# EAGLE design motor_shield__SD_v1.1 (EAGLE 7.6.0)
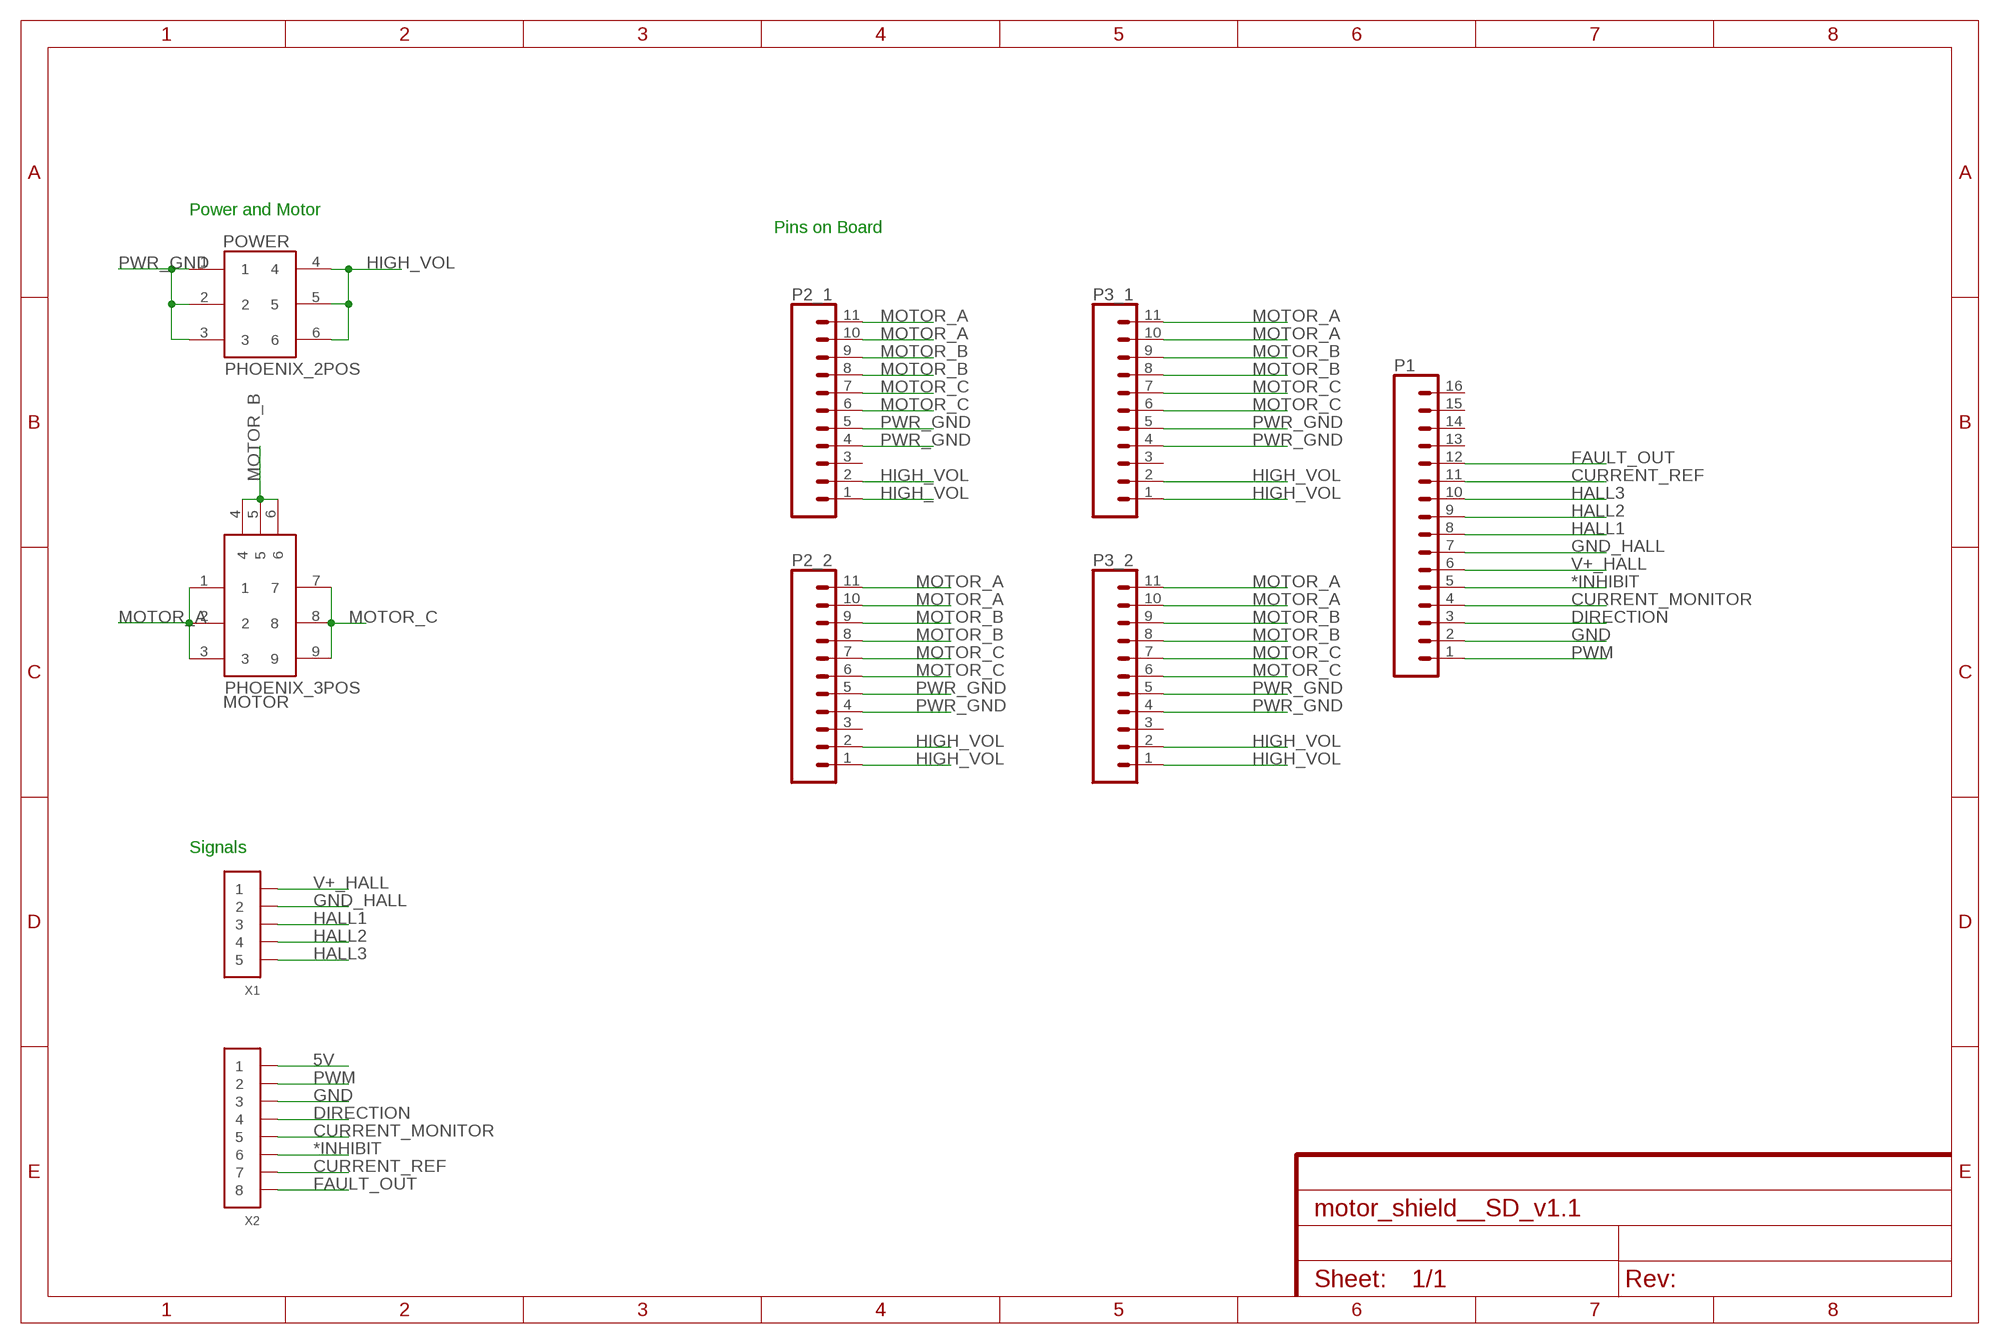
[diagram p0: schematic, sheet 1]

## Parts
MOTOR  PHOENIX_3POS  [PHOENIX_3POS]
P1  CONN_16LOCK  [1X16_LOCK]
P2_1  CONN_11  [1X11]
P2_2  CONN_11  [1X11]
P3_1  CONN_11  [1X11]
P3_2  CONN_11  [1X11]
POWER  PHOENIX_2POS  [PHOENIX_2POS]
X1  CONN_5-1-53261  [PB-53261-05]
X2  CONN_8-1-53261  [PB-53261-08]

## Nets
5V: X2.1
*INHIBIT: P1.5 X2.6
CURRENT_MONITOR: P1.4 X2.5
CURRENT_REF: P1.11 X2.7
DIRECTION: P1.3 X2.4
FAULT_OUT: P1.12 X2.8
GND: P1.2 X2.3
GND_HALL: P1.7 X1.2
HALL1: P1.8 X1.3
HALL2: P1.9 X1.4
HALL3: P1.10 X1.5
HIGH_VOL: P2_1.1 P2_1.2 P2_2.1 P2_2.2 P3_1.1 P3_1.2 P3_2.1 P3_2.2 POWER.4 POWER.5 POWER.6
MOTOR_A: MOTOR.1 MOTOR.2 MOTOR.3 P2_1.10 P2_1.11 P2_2.10 P2_2.11 P3_1.10 P3_1.11 P3_2.10 P3_2.11
MOTOR_B: MOTOR.4 MOTOR.5 MOTOR.6 P2_1.8 P2_1.9 P2_2.8 P2_2.9 P3_1.8 P3_1.9 P3_2.8 P3_2.9
MOTOR_C: MOTOR.7 MOTOR.8 MOTOR.9 P2_1.6 P2_1.7 P2_2.6 P2_2.7 P3_1.6 P3_1.7 P3_2.6 P3_2.7
PWM: P1.1 X2.2
PWR_GND: P2_1.4 P2_1.5 P2_2.4 P2_2.5 P3_1.4 P3_1.5 P3_2.4 P3_2.5 POWER.1 POWER.2 POWER.3
V+_HALL: P1.6 X1.1
Unconnected: P1.13 P1.14 P1.15 P1.16 P2_1.3 P2_2.3 P3_1.3 P3_2.3

## Notes on the sheet
- Power and Motor
- Pins on Board
- Signals

## Library data of the parts
MOTOR = phoenixConn_3POS:PHOENIX_3POS
P1 = SparkFun-Connectors:CONN_16: Multi connection point. Often used as Generic Header-pin footprint for 0.1 inch spaced/style header connections On any of the 0.1 inch spaced packages, you can populate with these: Break Away Headers - Straight <https://www.sparkfun.com/products/116> (PRT-00116) Break Away Male Headers - Right Angle <https://www.sparkfun.com/products/553> (PRT-00553) Female Headers <https://www.sparkfun.com/products/115> (PRT-00115) Break Away Headers - Machine Pin <https://www.sparkfun.com/products/117> (PRT-00117) Break Away Female Headers - Swiss Machine Pin <https://www.sparkfun.com/products/743> (PRT-00743) For SCREWTERMINALS and SPRING TERMINALS visit here: Screw Terimnals on SparkFun.com <https://www.sparkfun.com/search/results?term=Screw+Terminals> (5mm/3.5mm/2.54mm spacing) This device is also useful as a general connection point to wire up your design to another part of your project. Our various solder wires solder well into these plated through hole pads. Hook-Up Wire - Assortment (Stranded, 22 AWG) <https://www.sparkfun.com/products/11375> (PRT-11375) Hook-Up Wire - Assortment (Solid Core, 22 AWG) <https://www.sparkfun.com/products/11367> (PRT-11367) View the entire wire category on our website here <https://www.sparkfun.com/categories/141> Special notes: Molex polarized connector foot print use with SKU : PRT-08231 with associated crimp pins and housings. 1MM SMD Version SKU: PRT-10208 NOTES ON THE VARIANTS LOCK and LOCK_LONGPADS... This footprint was designed to help hold the alignment of a through-hole component (i.e. 6-pin header) while soldering it into place. You may notice that each hole has been shifted either up or down by 0.005 of an inch from it's more standard position (which is a perfectly straight line). This slight alteration caused the pins (the squares in the middle) to touch the edges of the holes. Because they are alternating, it causes a "brace" to hold the component in place. 0.005 has proven to be the perfect amount of "off-center" position when using our standard breakaway headers. Although looks a little odd when you look at the bare footprint, once you have a header in there, the alteration is very hard to notice. Also,if you push a header all the way into place, it is covered up entirely on the bottom side.
P2_1 P2_2 P3_1 P3_2 = SparkFun-Connectors:CONN_11: Multi connection point. Often used as Generic Header-pin footprint for 0.1 inch spaced/style header connections On any of the 0.1 inch spaced packages, you can populate with these: Break Away Headers - Straight <https://www.sparkfun.com/products/116> (PRT-00116) Break Away Male Headers - Right Angle <https://www.sparkfun.com/products/553> (PRT-00553) Female Headers <https://www.sparkfun.com/products/115> (PRT-00115) Break Away Headers - Machine Pin <https://www.sparkfun.com/products/117> (PRT-00117) Break Away Female Headers - Swiss Machine Pin <https://www.sparkfun.com/products/743> (PRT-00743) For SCREWTERMINALS and SPRING TERMINALS visit here: Screw Terimnals on SparkFun.com <https://www.sparkfun.com/search/results?term=Screw+Terminals> (5mm/3.5mm/2.54mm spacing) This device is also useful as a general connection point to wire up your design to another part of your project. Our various solder wires solder well into these plated through hole pads. Hook-Up Wire - Assortment (Stranded, 22 AWG) <https://www.sparkfun.com/products/11375> (PRT-11375) Hook-Up Wire - Assortment (Solid Core, 22 AWG) <https://www.sparkfun.com/products/11367> (PRT-11367) View the entire wire category on our website here <https://www.sparkfun.com/categories/141>
POWER = phoenixConn_2POS:PHOENIX_2POS
X1 = pel_molex:CONN_5-1
X2 = pel_molex:CONN_8-1

## Board
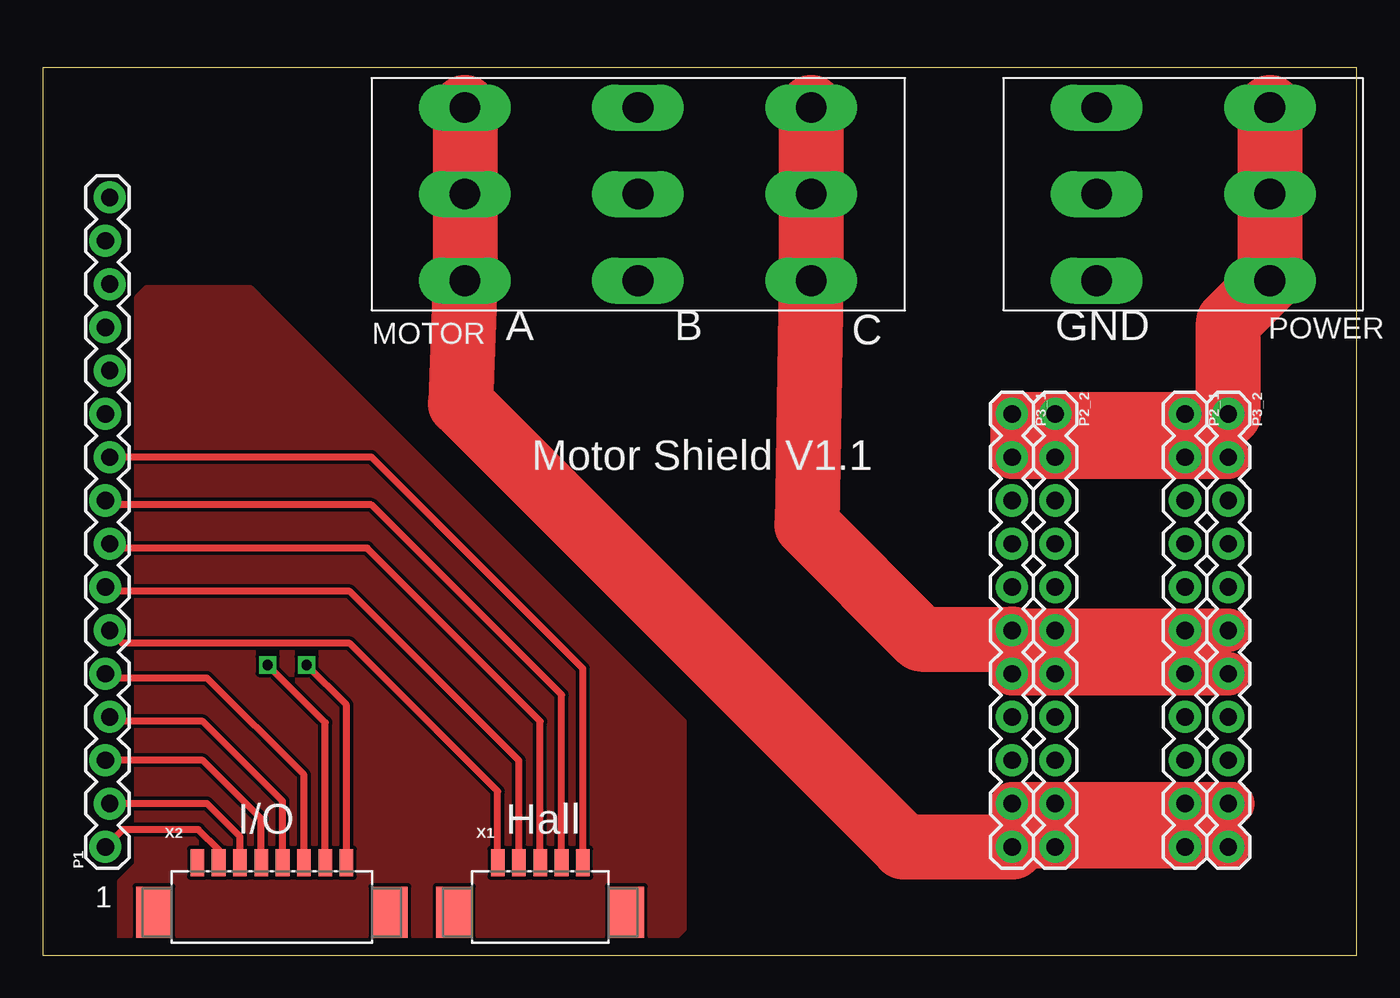
[diagram p1: board, top side]
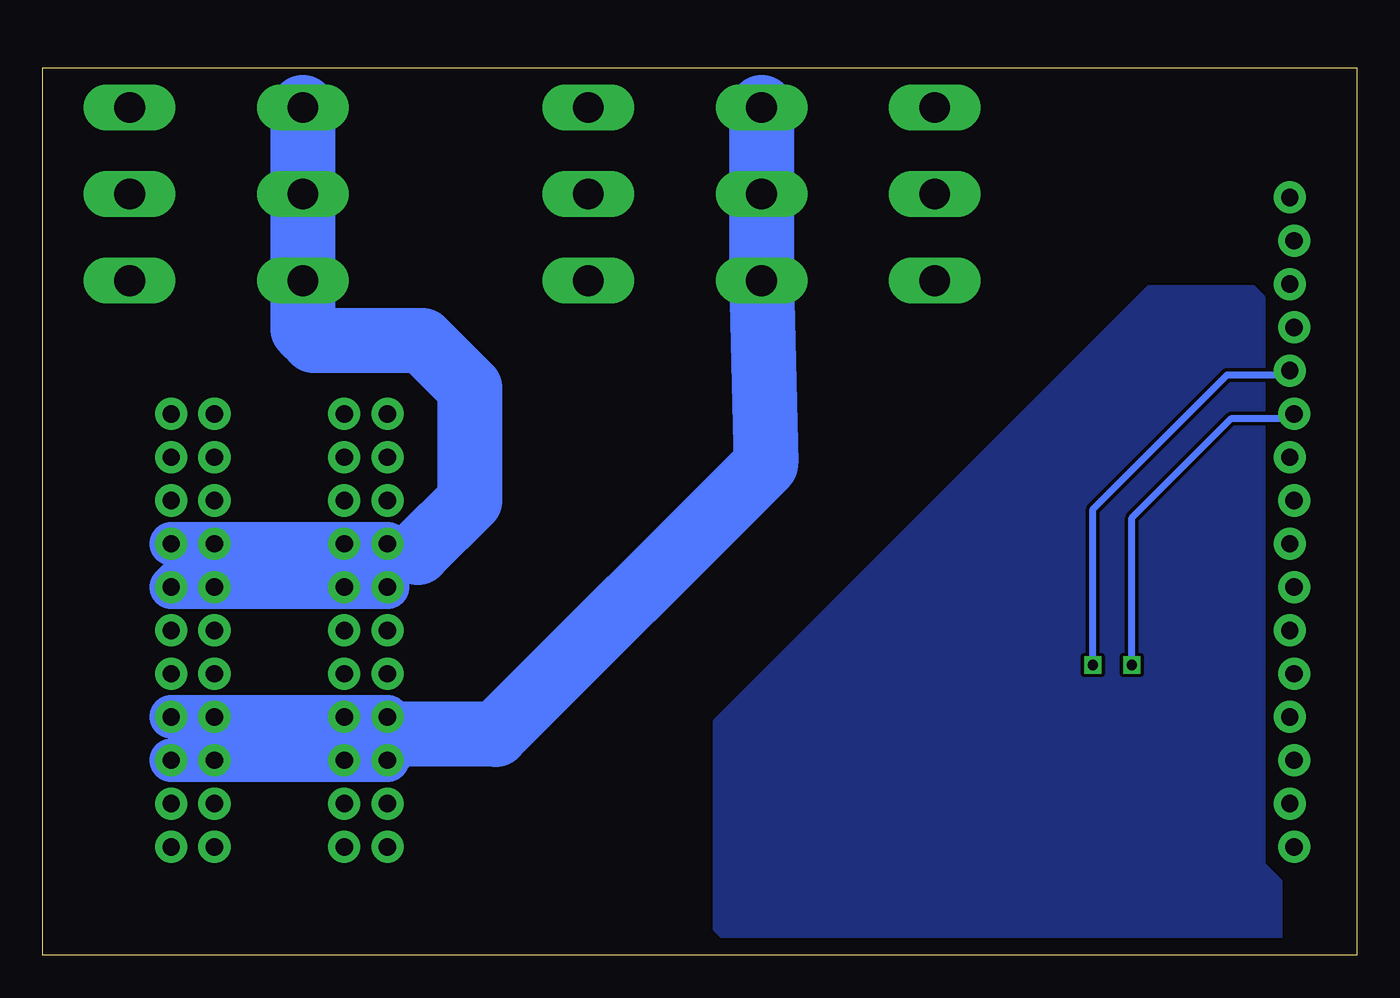
[diagram p2: board, bottom side, seen from below]

Size 77.14 x 52.06 mm. Coordinates in mm from the lower left corner, seen from the top.
Outline: 0,0 77.14,0 77.14,52.06 0,52.06 0,0
Copper layers (1*16): Top 0.035mm / dielectric 1.5mm / Bottom 0.035mm
Design rules "default": minimum track width 10mil, minimum drill 24mil, track to track 8mil, track to pad 8mil, pad to pad 8mil, via to via 8mil, smd to smd 8mil, copper to edge 40mil, drill to drill 8mil, minimum pad ring 10mil, minimum via ring 8mil, stop-mask expansion 4mil, vias tented up to drill 0mil, thermal gap 10mil

### Footprints (pad centres in the part's own frame; a part is rotated, then mirrored left to right if it is on the bottom)
PHOENIX_3POS = drill 1.8 long: 1 5.48,11.88; 2 5.48,6.8; 3 5.48,1.72; 4 15.64,11.88; 5 15.64,6.8; 6 15.64,1.72; 7 25.8,11.88; 8 25.8,6.8; 9 25.8,1.72
1X16_LOCK = drill 1.016 pad 1.88: 1 0,0.127; 2 2.54,-0.127; 3 5.08,0.127; 4 7.62,-0.127; 5 10.16,0.127; 6 12.7,-0.127; 7 15.24,0.127; 8 17.78,-0.127; 9 20.32,0.127; 10 22.86,-0.127; 11 25.4,0.127; 12 27.94,-0.127; 13 30.48,0.127; 14 33.02,-0.127; 15 35.56,0.127; 16 38.1,-0.127
1X11 = drill 1.016 pad 1.88: 1 0,0; 2 2.54,0; 3 5.08,0; 4 7.62,0; 5 10.16,0; 6 12.7,0; 7 15.24,0; 8 17.78,0; 9 20.32,0; 10 22.86,0; 11 25.4,0
PHOENIX_2POS = drill 1.8 long: 1 5.48,1.72; 2 5.48,6.8; 3 5.48,11.88; 4 15.64,11.88; 5 15.64,6.8; 6 15.64,1.72
PB-53261-05 = smd 0.8 x 1.6: 1 -2.5,1.1; 2 -1.25,1.1; 3 0,1.1; 4 1.25,1.1; 5 2.5,1.1 | smd 2.1 x 3: MNT1 -5.05,-1.8; MNT2 5.05,-1.8
PB-53261-08 = smd 0.8 x 1.6: 1 -4.375,1.1; 2 -3.125,1.1; 3 -1.875,1.1; 4 -0.625,1.1; 5 0.625,1.1; 6 1.875,1.1; 7 3.125,1.1; 8 4.375,1.1 | smd 2.1 x 3: MNT1 -6.925,-1.8; MNT2 6.925,-1.8

### Placement (x,y rotation side)
MOTOR  19.3,37.85 0 top
P1  3.81,6.35 90 top
P2_1  67.06,31.75 270 top
P2_2  59.44,31.75 270 top
P3_1  56.9,31.75 270 top
P3_2  69.6,31.75 270 top
POWER  56.39,37.85 0 top
X1  29.21,4.32 0 top
X2  13.46,4.32 0 top

### Tracks (layer width: path | path; a pad name or v marks a point on that pad's centre or on a via)
*INHIBIT
  Top 0.406: X2.6 15.34,10.57 9.65,16.26 3.94,16.26 P1.5
CURRENT_MONITOR
  Top 0.406: X2.5 14.09,9.03 9.4,13.72 4.19,13.72 P1.4
CURRENT_REF  (via drill 0.6)
  Top 0.406: X2.7 16.59,13.64 v13.21,17.02
  Bottom 0.406: v13.21,17.02 13.21,25.65 7.37,31.5 3.94,31.5 P1.11
DIRECTION
  Top 0.406: X2.4 12.84,7.99 9.4,11.43 P1.3
FAULT_OUT  (via drill 0.6)
  Top 0.406: X2.8 17.84,14.68 v15.49,17.02
  Bottom 0.406: v15.49,17.02 15.49,26.16 7.62,34.04 4.19,34.04 P1.12
GND
  Top 0.406: P1.2 9.65,8.89 11.59,6.96 X2.3
GND_HALL
  Top 0.406: X1.2 27.96,11.41 18.03,21.34 3.94,21.34 P1.7
HALL1
  Top 0.406: X1.3 29.21,13.72 19.05,23.88 4.19,23.88 P1.8
HALL2
  Top 0.406: X1.4 30.46,15.26 19.3,26.42 3.94,26.42 P1.9
HALL3
  Top 0.406: X1.5 31.71,16.8 19.3,29.21 P1.10
HIGH_VOL
  Top 2.54: P2_2.1 P2_1.1 | P2_1.1 P3_2.1 69.34,31.5 59.69,31.5 P2_2.1 | P2_2.2 P3_1.2 P3_1.1 P2_2.1 | P2_2.2 P2_1.2 | P2_1.2 P3_2.2 P2_1.1 | P2_2.1 P2_2.2 | P2_1.1 P2_1.2
  Top 3.81: POWER.4 POWER.5 POWER.6 69.6,37.13 P3_2.1
MOTOR_A
  Top 2.54: P3_1.10 58.93,8.89 | 58.93,8.89 P2_2.10 | P2_2.10 P2_1.10 | P2_1.10 P3_2.10 | 58.93,8.89 59.44,8.38 P2_2.11 P3_1.11 | 58.93,7.11 59.69,6.35 P2_1.11 P2_1.10 | 58.93,7.11 68.83,7.11 P3_2.11 | P2_1.10 69.85,8.89 | 58.93,7.11 58.93,8.38 P2_2.10
  Top 3.81: P3_1.11 50.55,6.35 24.53,32.37 MOTOR.3 MOTOR.2 MOTOR.1
MOTOR_B
  Bottom 2.54: P3_1.8 P2_2.8 | P2_2.9 P3_1.9 56.9,12.45 P3_1.8 | P3_1.8 57.15,13.97 59.69,11.43 P2_1.9 | P2_1.9 P3_2.9 | P3_1.8 P2_1.8 | P2_1.8 P3_2.8 | P2_1.9 P2_1.8
  Bottom 3.81: 56.9,12.45 56.39,12.95 50.55,12.95 34.69,28.81 MOTOR.6 MOTOR.5 MOTOR.4
MOTOR_C
  Top 2.54: P3_1.7 56.9,18.54 P3_1.6 P2_2.6 | P3_1.7 P2_2.7 | P2_2.7 P2_1.7 | P2_1.7 P3_2.7 | P2_2.6 P2_1.6 | P2_2.7 P2_2.6 | P2_1.7 P2_1.6 | P2_1.6 P3_2.6 P2_2.6 | P2_2.6 P3_1.7
  Top 3.81: 56.9,18.54 51.56,18.54 44.85,25.25 MOTOR.9 MOTOR.8 MOTOR.7
N$1
  pour Bottom: 4.32,0.25 36.32,0.25 37.59,1.52 37.59,13.72 29.97,21.34 12.19,39.12 6.1,39.12 5.59,38.61 5.59,5.33 4.57,4.32 4.57,0.51
N$2
  pour Top: 6.1,39.12 12.19,39.12 12.45,38.86 37.59,13.72 37.59,1.52 36.32,0.25 5.08,0.25 4.57,0.76 4.57,4.32 5.59,5.33 5.59,38.61
PWM
  Top 0.406: X2.2 10.34,6.17 9.14,7.37 4.7,7.37 P1.1
PWR_GND
  Bottom 2.54: P3_1.4 P3_1.5 P2_2.5 P2_1.5 | P2_1.4 P2_2.4 P3_1.4 | P2_1.4 P3_2.4 | P2_1.5 P3_2.5 P2_1.4 | P2_1.4 P2_1.5 | 55.12,23.62 56.39,23.62 P3_1.4
  Bottom 3.81: POWER.3 POWER.2 POWER.1 61.87,36.72 61.21,36.07 54.86,36.07 52.07,33.27 52.07,26.67 55.12,23.62
V+_HALL
  Top 0.406: X1.1 26.71,9.61 18.03,18.29 4.7,18.29 P1.6

### Text on the board
tPlace: A | B | C | GND | Motor Shield V1.1 | I/O | Hall | 1